# Altium project UPSV.PrjPcb
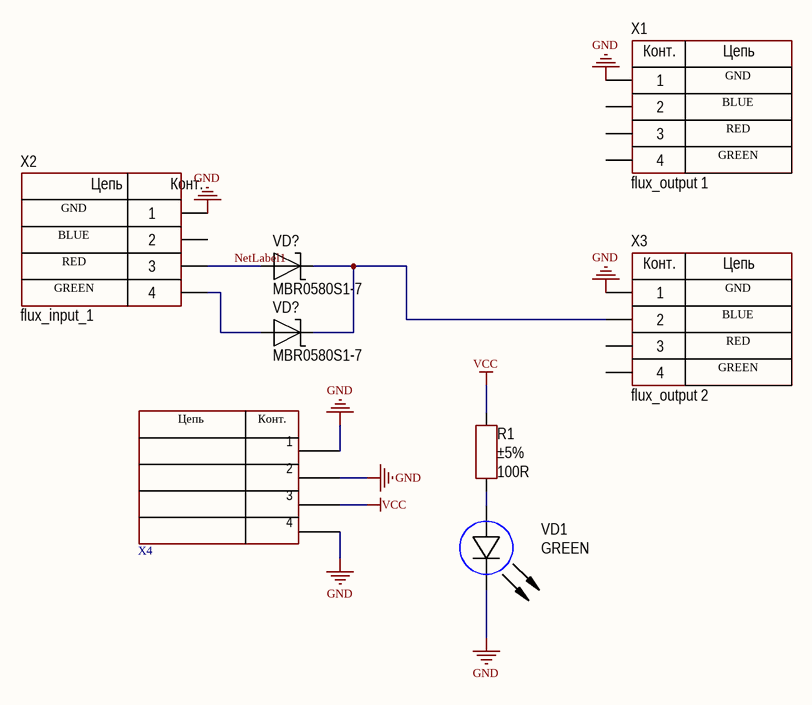
[diagram p0: upsv.SchDoc]
1 sheet, 8 parts. Net scope: global (net labels, ports and power ports of the same name join across sheets).
Board file: upsv.PcbDoc

## Sheet upsv.SchDoc
size 420 x 297 mm; Address1: Address1; Address2: Address2; Address3: Address3; Address4: Address4; DocumentNumber: АБВГ.123456.001 Э3; SheetNumber: 1; Scale: 1:1; DocumentType: Схема электрическая принципиальная; FirstReferrence: АБВГ.123456.001

### Parts
(Parts that share a designator on the sheet are numbered #1, #2 ... from top to bottom, then left to right.)
R1  value 100R  Tolerance: ±5%  [RES: 0603]
VD1  Color: GREEN  [LED: 0805B]
VD?#1  PartNumber: MBR0580S1-7  [DIODE: SOD523]
VD?#2  PartNumber: MBR0580S1-7  [DIODE: SOD523]
X1  CommentText: flux_output 1  [CON: PLS-4]
X2  CommentText: flux_input_1  [CON: PLS-4]
X3  CommentText: flux_output 2  [CON: PLS-4]
X4  PBS-4 cut  [PBS-4 CUT]  (value not drawn)

### Nets
GND: VD1.2(C) X1.1 X2.1 X3.1 X4.1 X4.2 X4.4
VCC: R1.2 X4.3
NetLabel1: VD?#1.1 X2.3
NetR1_1: R1.1 VD1.1(A)
NetVD?#1_2: VD?#1.2 VD?#2.2 X3.2
NetVD?#2_1: VD?#2.1 X2.4

Not connected (* = marked no-connect by the designer): X1 2 3 4; X2 2; X3 3 4

### Notes on the sheet
- (near X1) GND
- (near X1) BLUE
- (near X1) RED
- (near X2) GND
- (near X1) GREEN
- (near X2) RED
- (near X2) BLUE
- (near X2) GREEN
- (near X3) GND
- (near X3) BLUE
- (near X3) RED
- (near X3) GREEN
- Перв. примен.
- Справ. №
- Подп. и дата
- Инв. № дубл.
- Взам. инв. №
- Разраб.
- Изм.
- Лист
- № докум.
- Подп.
- Дата
- Лит.
- Масса
- Масштаб
- Пров.
- Т.контр.
- Листов
- Инв. № подл.
- Утв.
- Н.контр.
- 2.106-A3
- Копировал
- Формат А3
- (in symbol PBS-4 cut) Цепь; Конт.
- (in symbol PLS-4) Цепь; Конт.

### Library data of the parts
R1 = Resistor_0603: Manufacturer: Yageo; PartNumber: RC0603JR-07100RL; ValueManufacturerPartNumber: Resistor film, 100R, ±5%, 0603, 0.1W, -55...+125°C; TypeResistor: Resistor film; Power: 0.1W; Package: 0603; HelpURL: https://www.digikey.com/product-detail/en/yageo/RC0603JR-07100RL/311-100GRCT-ND/729644; Temperature: -55...+125°C
VD1 = LED_single: ValueManufacturerPartNumber: LED, *, *, *, -55...+150°C; TypeDiode: LED; Manufacturer: *; Package: *; HelpURL: *; Temperature: -55...+150°C; Current: *; VoltageDrop: *; PartNumber: *
VD?#1 VD?#2 = Schottky_single: Manufacturer: Diodes Incorporated; ValueManufacturerPartNumber: Schottky diode, 80V, 500mA, 1V, 15pF, SOD-123, -55...+150°C; TypeDiode: Schottky diode; Voltage: 80V; Current: 500mA; VoltageDrop: 1V; RecoveryTime: 15pF; Package: SOD-123; HelpURL: https://www.digikey.com/product-detail/en/diodes-incorporated/MBR0580S1-7/MBR0580S1-7DICT-ND/5080371; Temperature: -55...+150°C
X1-X3 = PLS-4: Manufacturer: Connfly; ValueManufacturerPartNumber: Connector, 4pin, 2.54mm, 500VAC, 3A; TypeConnector: Connector; VoltageMax: 500VAC; Pitch: 2.54mm; CurrentMax: 3A; Multichannel: 4pin; HelpURL: https://www.chipdip.ru/product/pls-4; PartNumber: PLS-4